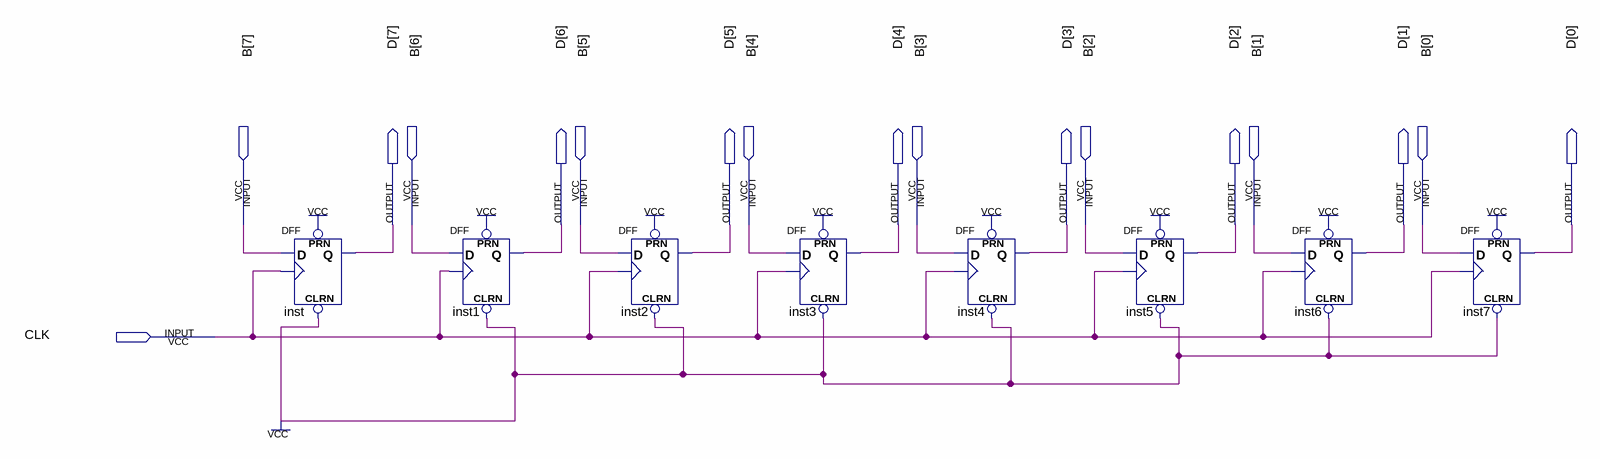
[diagram p0: schematic sheet]
// Quartus schematic Reg8bit.bdf as structural Verilog: 8 symbols, 17 pins
module Reg8bit (
  input  [7:0] B,
  input  CLK,
  output [7:0] D
);

  DFF inst (.CLRN(1'b1), .CLK(CLK), .D(B[7]), .PRN(1'b1), .Q(D[7]));
  DFF inst1 (.CLRN(1'b1), .CLK(CLK), .D(B[6]), .PRN(1'b1), .Q(D[6]));
  DFF inst2 (.CLRN(1'b1), .CLK(CLK), .D(B[5]), .PRN(1'b1), .Q(D[5]));
  DFF inst3 (.CLRN(1'b1), .CLK(CLK), .D(B[4]), .PRN(1'b1), .Q(D[4]));
  DFF inst4 (.CLRN(1'b1), .CLK(CLK), .D(B[3]), .PRN(1'b1), .Q(D[3]));
  DFF inst5 (.CLRN(1'b1), .CLK(CLK), .D(B[2]), .PRN(1'b1), .Q(D[2]));
  DFF inst6 (.CLRN(1'b1), .CLK(CLK), .D(B[1]), .PRN(1'b1), .Q(D[1]));
  DFF inst7 (.CLRN(1'b1), .CLK(CLK), .D(B[0]), .PRN(1'b1), .Q(D[0]));
endmodule
